# EasyEDA Pro project Fido2.epro

# Schematic Fido2
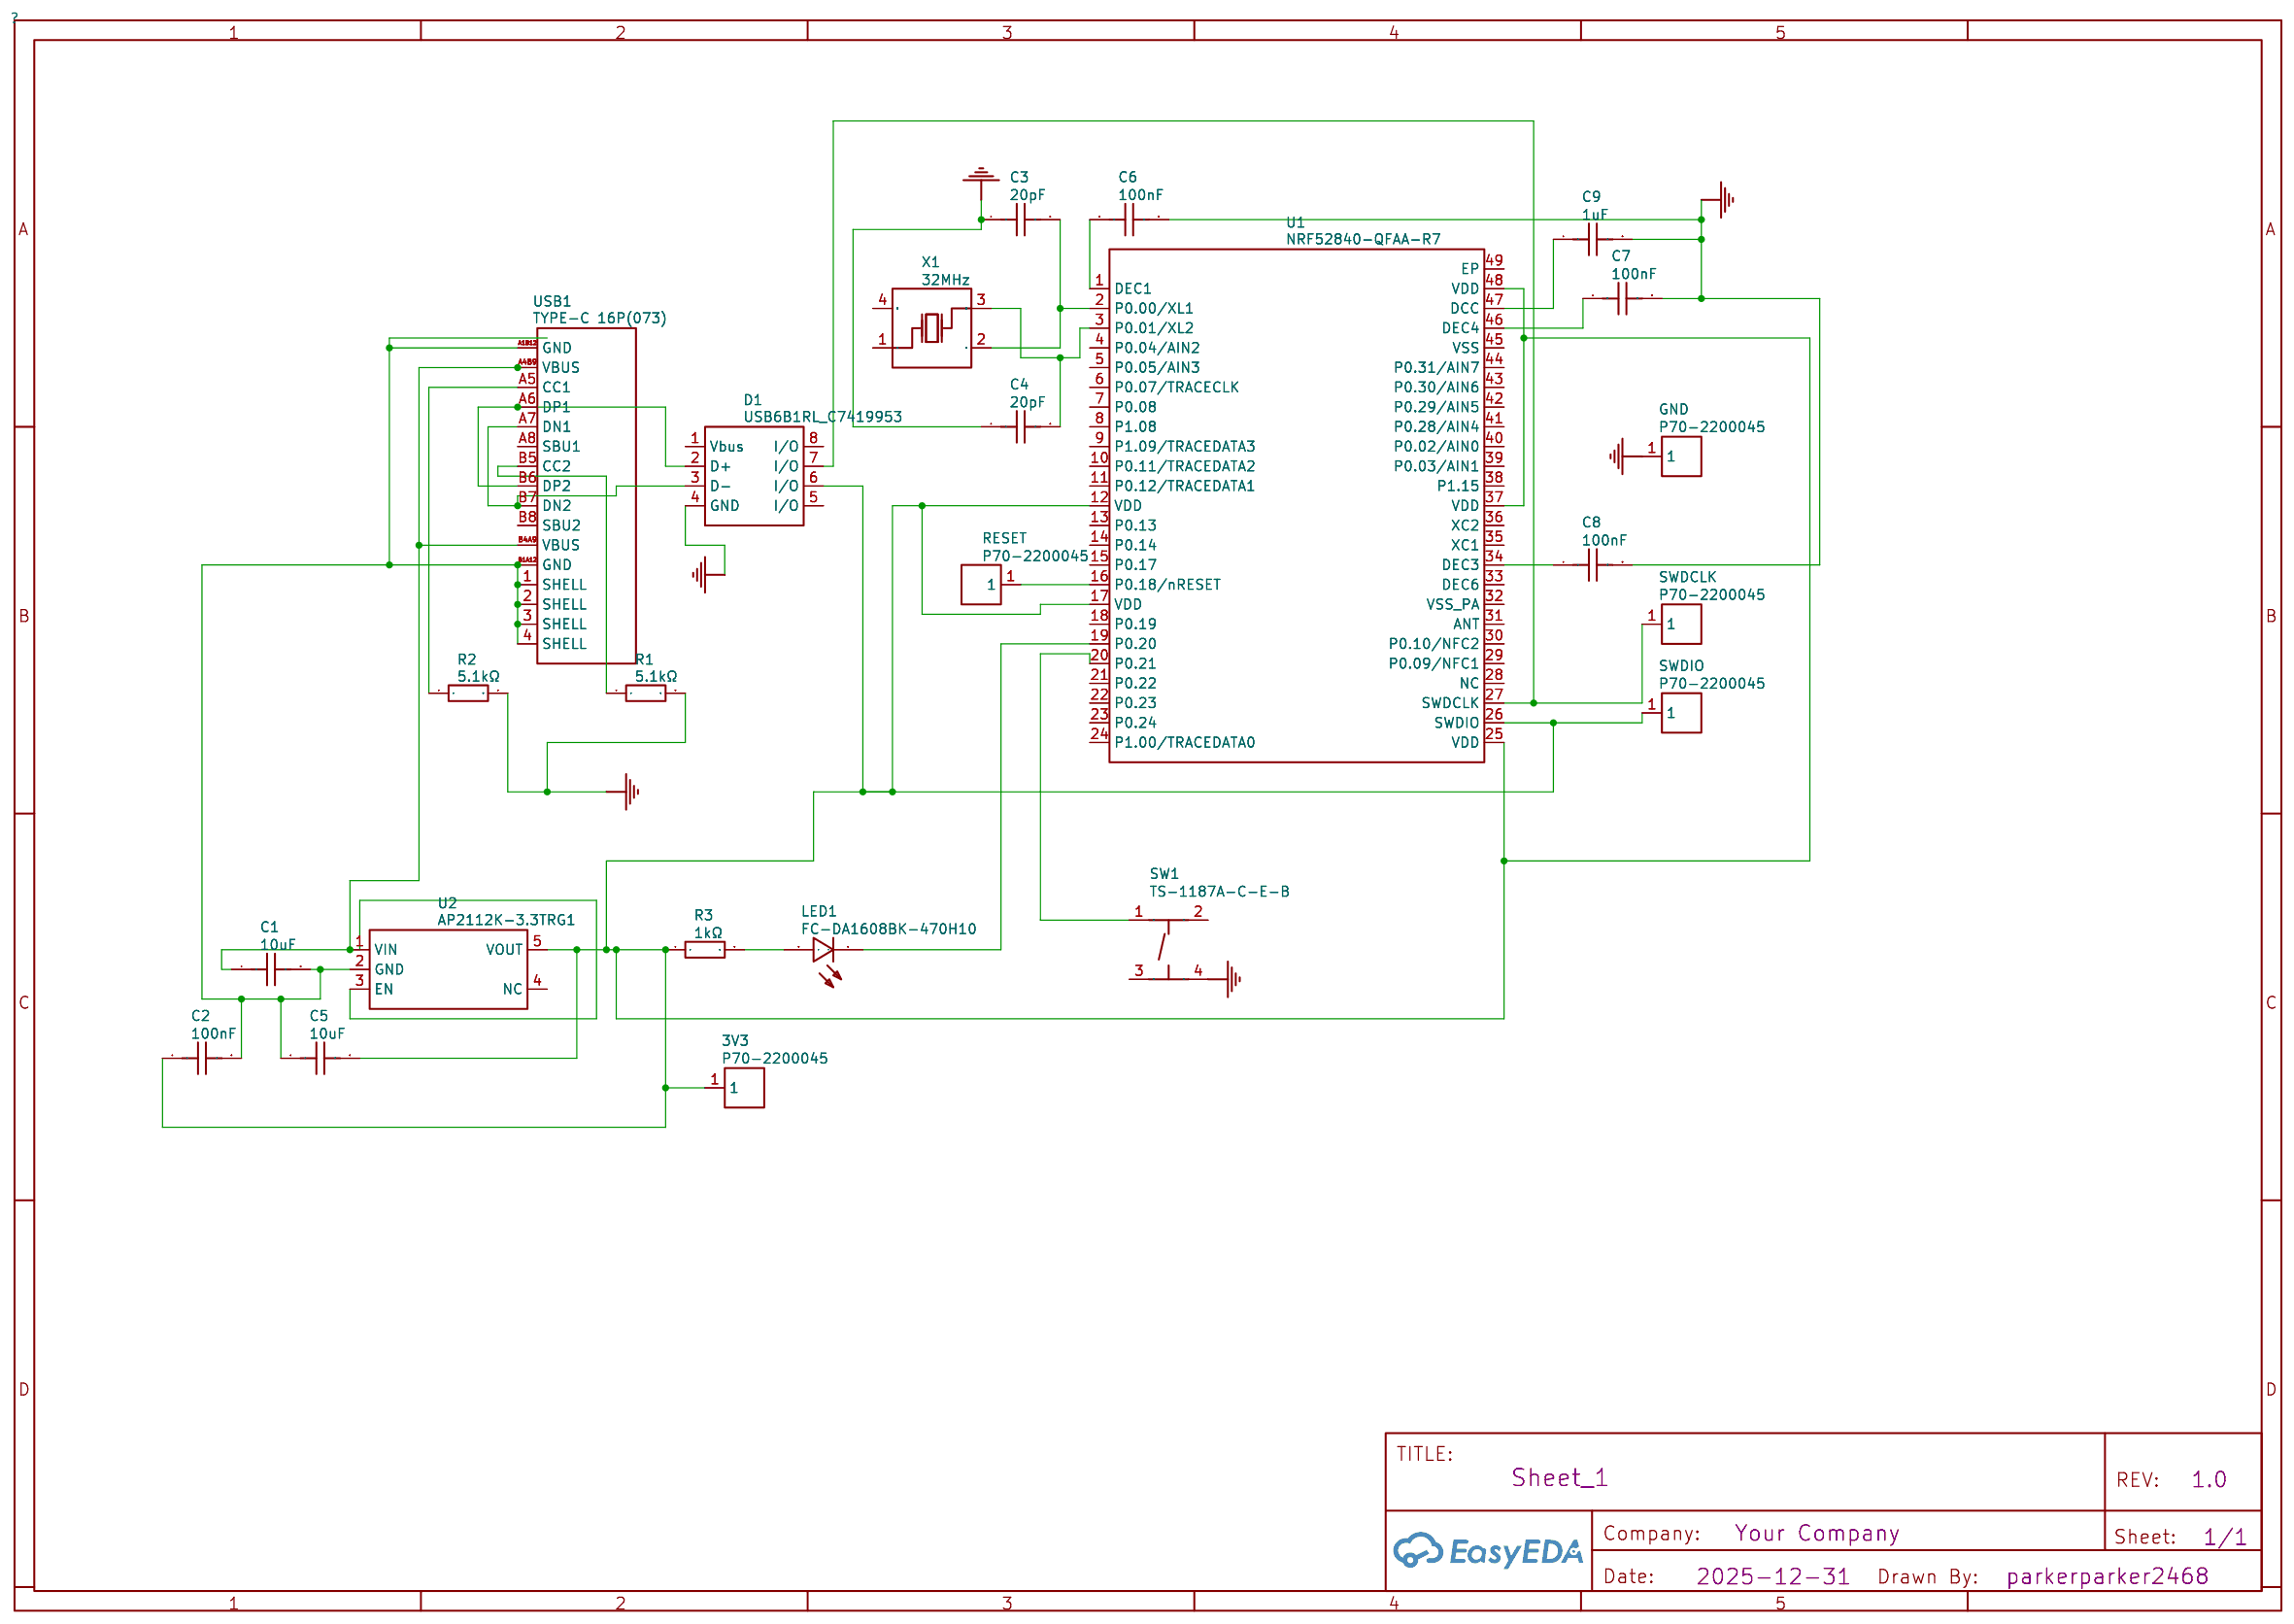
[diagram p0: schematic sheet]

## Parts
3V3  P70-2200045  [TESTPOINT-TH_BD2.0-D1.0_TESTPOINT-TH_BD2.0-D1.0]
C1  10uF  [C0603]
C2  100nF  [C0603]
C3  20pF  [C0603]
C4  20pF  [C0603]
C5  10uF  [C0603]
C6  100nF  [C0603]
C7  100nF  [C0603]
C8  100nF  [C0603]
C9  1uF  [C0603]
D1  USB6B1RL_C7419953  [SOP-8_L4.9-W3.9-P1.27-LS6.0-BL]
GND  P70-2200045  [TESTPOINT-TH_BD2.0-D1.0_TESTPOINT-TH_BD2.0-D1.0]
LED1  FC-DA1608BK-470H10  [LED0603-RD]
R1  5.1kΩ  [R0603]
R2  5.1kΩ  [R0603]
R3  1kΩ  [R0603]
RESET  P70-2200045  [TESTPOINT-TH_BD2.0-D1.0_TESTPOINT-TH_BD2.0-D1.0]
SW1  TS-1187A-C-E-B  [SW-SMD_4P-L5.1-W5.1-P3.70-LS6.5-TL_H2.5]
SWDCLK  P70-2200045  [TESTPOINT-TH_BD2.0-D1.0_TESTPOINT-TH_BD2.0-D1.0]
SWDIO  P70-2200045  [TESTPOINT-TH_BD2.0-D1.0_TESTPOINT-TH_BD2.0-D1.0]
U1  NRF52840-QFAA-R7  [QFN-48_L6.0-W6.0-P0.40-TL-EP4.6]
U2  AP2112K-3.3TRG1  [SOT-25-5_L2.9-W1.6-P0.95-LS2.8-BL]
USB1  TYPE-C 16P(073)  [USB-C-SMD_TYPE-C16PIN_C668624]
X1  32MHz  [CRYSTAL-SMD_4P-L3.2-W2.5-BL]

## Library data of the parts
3V3 RESET SWDCLK SWDIO = P70-2200045: Supplier: LCSC; Supplier Part: C21890164; Manufacturer: Harwin; JLCPCB Part Class: Extended Part; Contributor: lcsc; spicePre: U
C1 C5 = 10uF: Supplier: LCSC; Manufacturer: muRata(村田); Manufacturer Part: GRM188R61E106MA73D; Supplier Part: C91606; JLCPCB Part Class: Extended Part; nameAlias: Value; spicePre: C; spiceSymbolName: GRM188R61E106MA73D
C2 C6-C8 = 100nF: Supplier: LCSC; Manufacturer: YAGEO(国巨); Manufacturer Part: CC0603KRX7R9BB104; Supplier Part: C14663; JLCPCB Part Class: Basic Part; nameAlias: Value; spicePre: C; spiceSymbolName: CC0603KRX7R9BB104
C3 C4 = 20pF: Supplier: LCSC; Manufacturer: FH(风华); Manufacturer Part: 0603CG200J500NT; Supplier Part: C91702; JLCPCB Part Class: Extended Part; nameAlias: Value; spicePre: C; spiceSymbolName: 0603CG200J500NT
C9 = 1uF: Supplier: LCSC; Manufacturer Part: CL10A105KB8NNNC; Manufacturer: SAMSUNG(三星); Supplier Part: C15849; JLCPCB Part Class: Basic Part; nameAlias: Value; spicePre: C; spiceSymbolName: CL10A105KB8NNNC
D1 = USB6B1RL_C7419953: Supplier: LCSC; Supplier Part: C7419953; Manufacturer: TECH PUBLIC(台舟); Manufacturer Part: USB6B1RL; JLCPCB Part Class: Extended Part; Contributor: lcsc; spicePre: D
GND = P70-2200045: Supplier: LCSC; Supplier Part: C21890164; Manufacturer: Harwin; JLCPCB Part Class: Extended Part; Contributor: lcsc; spicePre: U; Package Display: No
LED1 = FC-DA1608BK-470H10: Supplier: LCSC; Manufacturer: 国星光电; Manufacturer Part: NCD0603B1; Supplier Part: C84266; JLCPCB Part Class: Extended Part; spicePre: L
R1 R2 = 5.1kΩ: Supplier: LCSC; Manufacturer: YAGEO(国巨); Manufacturer Part: RC0603FR-075K1L; Supplier Part: C105580; JLCPCB Part Class: Extended Part; nameAlias: Value; spicePre: R; spiceSymbolName: RC0603FR-075K1L
R3 = 1kΩ: Supplier: LCSC; Manufacturer Part: RC0603FR-071KL; Manufacturer: YAGEO(国巨); Supplier Part: C22548; JLCPCB Part Class: Extended Part; nameAlias: Value; spicePre: R; spiceSymbolName: RC0603FR-071KL
SW1 = TS-1187A-C-E-B: Supplier: LCSC; Supplier Part: C318887; Manufacturer: XKB Connection(中国星坤); JLCPCB Part Class: Extended Part; Contributor: LCSC; spicePre: S
U1 = NRF52840-QFAA-R7: Supplier: LCSC; Supplier Part: C3606765; Manufacturer: NORDIC; JLCPCB Part Class: Extended Part; Contributor: lcsc; spicePre: U
U2 = AP2112K-3.3TRG1: Supplier: LCSC; Manufacturer: DIODES(美台); Supplier Part: C51118; JLCPCB Part Class: Extended Part; Contributor: LCSC; spicePre: U
USB1 = TYPE-C 16P(073): Supplier: LCSC; Supplier Part: C668624; Manufacturer: SHOU HAN(首韩); JLCPCB Part Class: Extended Part; Contributor: LCSC; spicePre: U
X1 = 32MHz: Supplier: LCSC; Manufacturer: YXC(扬兴晶振); Manufacturer Part: X322532MOB4SI; Supplier Part: C9009; JLCPCB Part Class: Extended Part; nameAlias: Value; spicePre: X; spiceSymbolName: X322532MOB4SI

## Nets
GND: C3.1 C4.1 C6.2 C7.2 C8.2 C9.2 D1.4(GND) GND.1 R1.2 R2.2 SW1.4(D)
LED1_2: LED1.2(+) R3.2
U1_1: C6.1 U1.1(DEC1)
U1_2: C3.2 U1.2(P0.00/XL1) X1.2(GND)
U1_3: C4.2 U1.3(P0.01/XL2) X1.3(OSC2)
U1_12: 3V3.1 C2.1 C5.2 R3.1 U1.12(VDD) U1.17(VDD) U1.25(VDD) U1.37(VDD) U1.48(VDD) U2.5(VOUT)
U1_16: RESET.1 U1.16(P0.18/nRESET)
U1_19: LED1.1(-) U1.19(P0.20)
U1_20: SW1.1(A) U1.20(P0.21)
U1_26: D1.6(I/O) SWDIO.1 U1.26(SWDIO)
U1_27: D1.7(I/O) SWDCLK.1 U1.27(SWDCLK)
U1_34: C8.1 U1.34(DEC3)
U1_46: C7.1 U1.46(DEC4)
U1_47: C9.1 U1.47(DCC)
USB1_4: C1.2 C2.2 C5.1 U2.2(GND) USB1.1(SHELL) USB1.2(SHELL) USB1.3(SHELL) USB1.4(SHELL) USB1.A1B12(GND) USB1.B1A12(GND)
USB1_A5: R2.1 USB1.A5(CC1)
USB1_B4A9: C1.1 U2.1(VIN) U2.3(EN) USB1.A4B9(VBUS) USB1.B4A9(VBUS)
USB1_B5: R1.1 USB1.B5(CC2)
USB1_B6: D1.2(D+) USB1.A6(DP1) USB1.B6(DP2)
USB1_B7: D1.3(D-) USB1.A7(DN1) USB1.B7(DN2)

Not connected (* = marked no-connect by the designer): D1 1(Vbus) 5(I/O) 8(I/O); SW1 2(B) 3(C); U1 4(P0.04/AIN2) 5(P0.05/AIN3) 6(P0.07/TRACECLK) 7(P0.08) 8(P1.08) 9(P1.09/TRACEDATA3) 10(P0.11/TRACEDATA2) 11(P0.12/TRACEDATA1) 13(P0.13) 14(P0.14) 15(P0.17) 18(P0.19) 21(P0.22) 22(P0.23) 23(P0.24) 24(P1.00/TRACEDATA0) 28(NC) 29(P0.09/NFC1) 30(P0.10/NFC2) 31(ANT) 32(VSS_PA) 33(DEC6) 35(XC1) 36(XC2) 38(P1.15) 39(P0.03/AIN1) 40(P0.02/AIN0) 41(P0.28/AIN4) 42(P0.29/AIN5) 43(P0.30/AIN6) 44(P0.31/AIN7) 45(VSS) 49(EP); U2 4(NC); USB1 A8(SBU1) B8(SBU2); X1 1(OSC1) 4(GND)

# Board PCB_Fido2
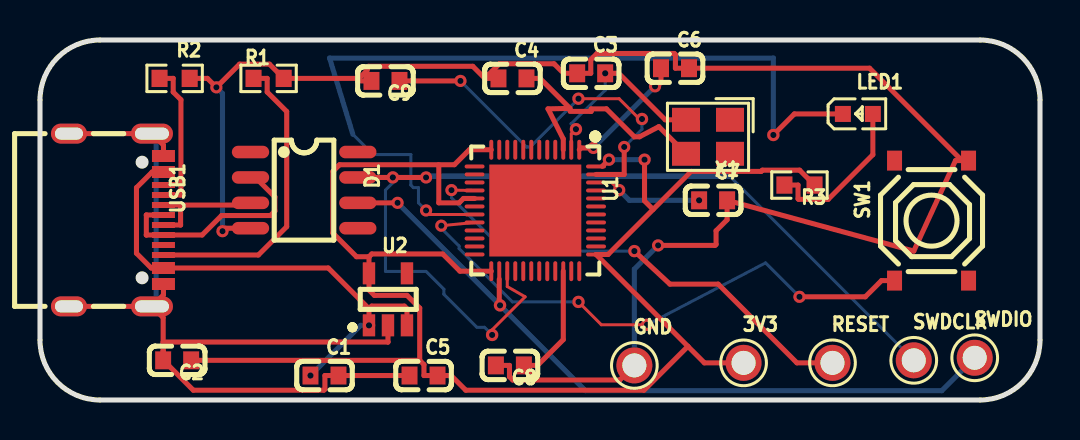
[diagram p1: board, top side]
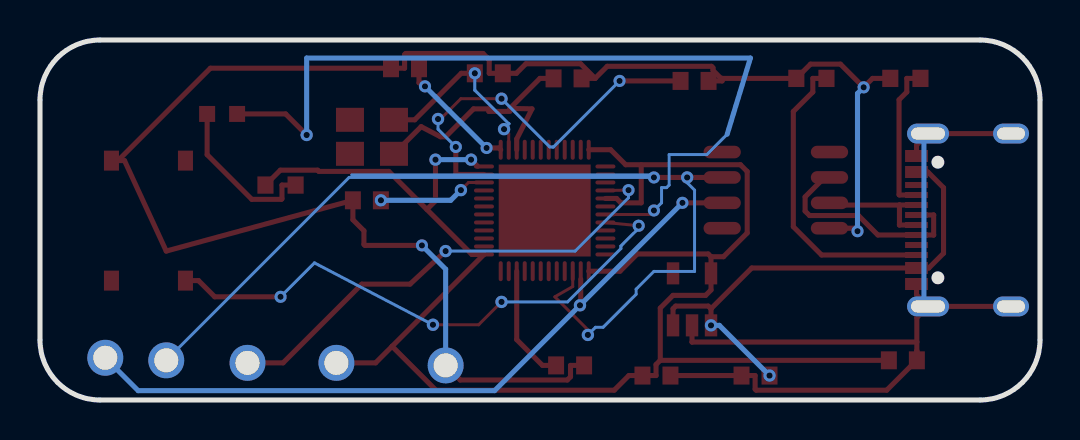
[diagram p2: board, bottom side, seen from below]

Outline 50 x 18 mm; copper layers: Top Layer, Bottom Layer. Coordinates in mm from the lower left corner of the outline.
Outline path: 0,15 arc(0.88,17.12) 3,18 47,18 arc(49.12,17.12) 50,15 50,3 arc(49.12,0.88) 47,0 3,0 arc(0.88,0.88) 0,3 0,15

## Design rules (mm)
via Default (default): diameter min 0.61, default 0.61, max 100.025; hole min 0.305, default 0.305, max 59.995

## Placement (name value [footprint] x y rotation side)
3V3  P70-2200045  [TESTPOINT-TH_BD2.0-D1.0_TESTPOINT-TH_BD2.0-D1.0]  35.18 1.86 0 top
C1  10uF  [C0603]  14.22 1.22 0 top
C2  100nF  [C0603]  6.86 1.98 180 top
C3  20pF  [C0603]  27.56 16.33 0 top
C4  20pF  [C0603]  23.62 16.08 0 top
C5  10uF  [C0603]  19.18 1.22 0 top
C6  100nF  [C0603]  31.75 16.59 0 top
C7  100nF  [C0603]  33.66 9.98 0 top
C8  100nF  [C0603]  23.5 1.73 180 top
C9  1uF  [C0603]  17.27 15.95 180 top
D1  USB6B1RL_C7419953  [SOP-8_L4.9-W3.9-P1.27-LS6.0-BL]  13.21 10.49 270 top
GND  P70-2200045  [TESTPOINT-TH_BD2.0-D1.0_TESTPOINT-TH_BD2.0-D1.0]  29.72 1.73 0 top
LED1  FC-DA1608BK-470H10  [LED0603-RD]  40.89 14.3 0 top
R1  5.1kΩ  [R0603]  11.43 16.08 0 top
R2  5.1kΩ  [R0603]  6.73 16.08 0 top
R3  1kΩ  [R0603]  37.97 10.75 180 top
RESET  P70-2200045  [TESTPOINT-TH_BD2.0-D1.0_TESTPOINT-TH_BD2.0-D1.0]  39.62 1.86 0 top
SW1  TS-1187A-C-E-B  [SW-SMD_4P-L5.1-W5.1-P3.70-LS6.5-TL_H2.5]  44.58 8.97 90 top
SWDCLK  P70-2200045  [TESTPOINT-TH_BD2.0-D1.0_TESTPOINT-TH_BD2.0-D1.0]  43.69 1.98 0 top
SWDIO  P70-2200045  [TESTPOINT-TH_BD2.0-D1.0_TESTPOINT-TH_BD2.0-D1.0]  46.74 2.11 0 top
U1  NRF52840-QFAA-R7  [QFN-48_L6.0-W6.0-P0.40-TL-EP4.6]  24.76 9.48 270 top
U2  AP2112K-3.3TRG1  [SOT-25-5_L2.9-W1.6-P0.95-LS2.8-BL]  17.4 5.03 0 top
USB1  TYPE-C 16P(073)  [USB-C-SMD_TYPE-C16PIN_C668624]  3.81 9 270 top
X1  32MHz  [CRYSTAL-SMD_4P-L3.2-W2.5-BL]  33.4 13.16 180 top

## Footprints (pads in the part's own frame, mm; a bottom-side part is the same pattern mirrored in y, then rotated)
C0603
  rect 0.8x0.9 smd: 1(-0.7,0) 2(0.7,0)
CRYSTAL-SMD_4P-L3.2-W2.5-BL
  rect 1.4x1.2 smd: 1(-1.1,-0.85) 2(1.1,-0.85) 3(1.1,0.85) 4(-1.1,0.85)
LED0603-RD
  rect 0.8x0.8 smd: 1(-0.749,0) 2(0.749,0)
QFN-48_L6.0-W6.0-P0.40-TL-EP4.6
  oval 1x0.2 smd: 1(-3.036,2.199) 2(-3.036,1.798) 3(-3.036,1.399) 4(-3.036,0.999) 5(-3.036,0.599) 6(-3.036,0.199) 7(-3.036,-0.201) 8(-3.036,-0.602) 9(-3.036,-1.001) 10(-3.036,-1.401) 11(-3.036,-1.802) 12(-3.036,-2.201) 25(3.036,-2.201) 26(3.036,-1.802) 27(3.036,-1.401) 28(3.036,-1.001) 29(3.036,-0.602) 30(3.036,-0.201) 31(3.036,0.199) 32(3.036,0.599) 33(3.036,0.999) 34(3.036,1.399) 35(3.036,1.798) 36(3.036,2.199)
  oval 0.2x1 smd: 13(-2.199,-3.036) 14(-1.799,-3.036) 15(-1.399,-3.036) 16(-0.999,-3.036) 17(-0.599,-3.036) 18(-0.199,-3.036) 19(0.201,-3.036) 20(0.601,-3.036) 21(1.001,-3.036) 22(1.401,-3.036) 23(1.801,-3.036) 24(2.201,-3.036) 37(2.201,3.036) 38(1.801,3.036) 39(1.401,3.036) 40(1.001,3.036) 41(0.601,3.036) 42(0.201,3.036) 43(-0.199,3.036) 44(-0.599,3.036) 45(-0.999,3.036) 46(-1.399,3.036) 47(-1.799,3.036) 48(-2.199,3.036)
  rect 4.6x4.6 smd: 49(0.003,0.001)
R0603
  rect 0.806x0.864 smd: 1(-0.753,0) 2(0.753,0)
SOP-8_L4.9-W3.9-P1.27-LS6.0-BL
  oval 0.63x1.865 smd: 1(-1.905,-2.683) 2(-0.635,-2.683) 3(0.635,-2.683) 4(1.905,-2.683) 5(1.905,2.683) 6(0.635,2.683) 7(-0.635,2.683) 8(-1.905,2.683)
SOT-25-5_L2.9-W1.6-P0.95-LS2.8-BL
  rect 0.623x1.105 smd: 1(-0.95,-1.3) 2(-0.001,-1.3) 3(0.95,-1.3) 4(0.95,1.3) 5(-0.95,1.3)
SW-SMD_4P-L5.1-W5.1-P3.70-LS6.5-TL_H2.5
  rect 1x0.75 smd: 1(-3,1.85) 2(3,1.85) 3(-3,-1.85) 4(3,-1.85)
TESTPOINT-TH_BD2.0-D1.0_TESTPOINT-TH_BD2.0-D1.0
  round 1.8 hole 1.2: 1(0,0)
USB-C-SMD_TYPE-C16PIN_C668624
  oval 1x2.1 hole 0.6x1.7: 1(-4.32,1.788) 2(4.32,1.788)
  oval 1x1.8 hole 0.6x1.4: 3(-4.32,-2.362) 4(4.32,-2.362)
  rect 0.6x1.15 smd: A1B12(-3.2,2.362) A4B9(-2.4,2.362) B1A12(3.2,2.362) B4A9(2.4,2.362)
  rect 0.3x1.15 smd: A5(-1.25,2.362) A6(-0.25,2.362) A7(0.25,2.362) A8(1.25,2.362) B5(1.75,2.362) B6(0.75,2.362) B7(-0.75,2.362) B8(-1.75,2.362)

## Nets
As in the schematic.

## Via types
v1: diameter 0.61, hole 0.305, Top Layer to Bottom Layer, 13 vias
v2: diameter 0.62, hole 0.31, Top Layer to Bottom Layer, 17 vias

## Routing (per net, layer and track width the routed paths; a pad name or vN(x,y) marks a point on that pad's centre or on a via; arc(x,y) is an arc through that point)
GND: length 89.4
  Top Layer w0.254: R2.2 8.37,16.08 v1(8.82,15.63) 9.98,16.79 11.47,16.79 R1.2 15.89,16.08 ; GND.1 28.99,1 23.63,1 23.47,1.16 23.47,1.73 22.79,1.73 ; 46.1,11.97 41.48,16.59 C6.2 31.77,16.59 31.77,17.27 31.71,17.33 27.85,17.33 27.54,17.01 27.54,16.33 C3.1 26.18,16.33 25.7,16.81 22.97,16.81 22.24,16.08 ; 46.1,11.97 45.77,11.97 ; 46.1,11.97 SW1.4 ; 22.24,16.08 21.64,16.69 16.42,16.69 16.35,16.61 16.35,16.48 15.95,16.08 15.89,16.08 ; 22.24,16.08 C4.1 ; 15.89,16.08 15.89,15.95 C9.2 ; v1(9.12,8.44) 9.27,8.59 D1.4 ; 45.77,11.97 43.69,7.44 C7.2 34.35,9.01 33.8,8.46 33.8,7.78 33.75,7.73 v1(30.91,7.73)
  Bottom Layer w0.254: v1(30.91,7.73) 29.72,6.54 GND.1 ; v1(8.82,15.63) 9.12,15.33 v1(9.12,8.44)
LED1_2: length 8.1
  Top Layer w0.254: R3.2 37.9,10.75 37.9,10.06 37.93,10.03 39.41,10.03 41.64,12.27 LED1.2
U1_1: length 6.2
  Top Layer w0.254: U1.1 27.05,12.6 v1(27.67,12.6) ; v1(30.75,15.68) 30.93,15.86 31.05,15.86 C6.1
  Bottom Layer w0.254: v1(27.67,12.6) v1(30.75,15.68)
U1_2: length 9.7
  Top Layer w0.15: v2(26.8,13.54) 26.56,13.31 U1.2
  Top Layer w0.254: X1.2 31.26,14.01 28.94,16.33 v2(28.26,16.33)
  Bottom Layer w0.15: 26.56,13.81 28.26,15.49 28.26,16.33 ; 26.55,13.81 26.8,13.56 v2(26.8,13.54)
U1_3: length 13.3
  Top Layer w0.254: C4.2 25,16.08 26.5,14.58 25.4,14.56 26.16,13.05 U1.3 ; 26.5,14.43 27.56,14.43 27.56,14.56 28.32,14.56 29.72,13.16 29.97,13.16 30.94,13.67 32.3,12.31
U1_12: length 85.5
  Top Layer w0.15: 21.37,10.11 21.37,10.08
  Top Layer w0.254: 18.99,1.98 18.99,4.6 18.35,5.23 16.72,5.23 16.45,5.5 U2.5 16.45,7.16 ; 18.99,1.98 C2.1 ; 18.99,1.98 19.2,1.77 19.2,1.22 20.56,1.22 21.29,0.49 30.2,0.49 32.39,2.68 ; U1.25 21,6.44 20.14,7.3 16.59,7.3 16.45,7.16 ; 30.66,9.53 30.23,9.96 v2(30.23,12.02) ; 32.39,2.68 33.22,1.86 3V3.1 ; 32.39,2.68 U1.37 28.4,7.28 32.56,11.43 36.06,11.43 36.12,11.49 37.98,11.49 R3.1 ; 16.45,7.16 15.83,7.16 14.64,8.35 14.64,11.43 14.98,11.76 20.72,11.76 21.47,12.51 U1.12 ; 19.94,11.76 19.94,9.86 20.95,9.86 21.17,10.08 U1.17 ; v2(28.45,12.02) 28.12,11.68
  Bottom Layer w0.254: v2(28.45,12.02) v2(30.23,12.02)
U1_16: length 24
  Top Layer w0.15: v1(20.57,10.49) U1.16
  Top Layer w0.254: v2(29.72,7.44) 31.5,5.79 33.91,5.79 37.85,1.86 RESET.1
  Bottom Layer w0.15: v2(29.72,7.44) 23.24,7.44 20.57,10.11 v1(20.57,10.49)
U1_19: length 43.1
  Top Layer w0.15: v1(19.3,9.48) 19.5,9.28 U1.19
  Top Layer w0.254: 36.58,13.16 37.72,14.3 LED1.1
  Bottom Layer w0.15: 15.64,13.29 16.66,12.27 18.54,12.27 18.54,10.75 18.67,10.62 18.92,10.62 18.92,9.86 v1(19.3,9.48)
  Bottom Layer w0.254: v2(36.67,13.25) 36.67,17.1 14.48,17.1 15.64,13.29
U1_20: length 28.3
  Top Layer w0.15: v1(20.07,8.72) U1.20 21.73,8.87 ; v2(30.35,3.76) 28.07,3.76 v2(26.92,4.91)
  Top Layer w0.254: SW1.1 42.07,5.97 41.26,5.16 v1(37.97,5.16)
  Bottom Layer w0.15: v2(26.92,4.91) 23.62,4.91 20.95,7.57 20.95,7.7 20.19,8.46 20.19,8.59 v1(20.07,8.72) ; v1(37.97,5.16) 36.28,6.86 v2(30.35,3.76)
U1_26: length 36.7
  Top Layer w0.254: D1.6 v1(17.88,9.86) ; 22.96,6.03 22.96,4.77 v2(23,4.73)
  Bottom Layer w0.254: v1(17.88,9.86) v2(23,4.73) 27.27,0.47 45.09,0.47 SWDIO.1
U1_27: length 62.8
  Top Layer w0.15: 23.36,6.44 23.36,5.67 24.26,5.16 22.61,3.51 v2(22.61,3.25)
  Top Layer w0.254: D1.7 v2(17.64,11.13) v1(19.3,11.13)
  Bottom Layer w0.15: v2(17.64,11.13) 17.64,10.86 17.27,10.49 17.27,6.43 19.3,6.43 20.19,5.54 20.19,5.29 21.84,3.64 22.22,3.64 v2(22.61,3.25) ; 34.42,11.25 19.43,11.25 v1(19.3,11.13) 34.54,11.13 SWDCLK.1
U1_34: length 5.9
  Top Layer w0.254: U1.34 26.16,3.02 24.87,1.73 C8.1
U1_46: length 5.5
  Top Layer w0.15: U1.46 28.57,10.88 v2(28.96,10.49)
  Bottom Layer w0.254: v2(28.96,10.49) 29.46,9.98 v2(32.95,9.98)
U1_47: length 19.5
  Top Layer w0.15: v2(30.1,14.05) 29.97,14.18 29.84,14.18 28.96,15.06 v2(26.92,15.06)
  Top Layer w0.254: C9.1 v1(21.02,15.95) ; 27.8,11.28 29.21,11.28 v1(29.21,12.65)
  Bottom Layer w0.15: v1(29.21,12.65) 30.1,13.54 v2(30.1,14.05) ; v2(26.92,15.06) 24.51,12.65 24.32,12.65 ; v1(21.02,15.95) 24.32,12.65 ; 24.32,12.65 24.38,12.65
USB1_4: length 48.9
  Top Layer w0.254: USB1.A1B12 6.17,12.75 USB1.1 USB1.3 ; USB1.4 USB1.2 ; USB1.2 6.17,5.25 USB1.B1A12 ; USB1.2 6.16,4.12 6.16,2.9 ; 6.16,2.46 6.16,2 7.66,0.49 14.19,0.49 14.25,0.54 14.25,1.22 C1.2 C5.1 ; 6.16,2.46 C2.2 ; 6.16,2.46 6.16,2.9 ; 6.16,2.9 17.4,2.9 17.4,2.9 U2.2
  Bottom Layer w0.254: USB1.1 5.8,13.11 5.8,4.89 USB1.2
USB1_A5: length 7.5
  Top Layer w0.254: R2.1 6.66,16.08 6.66,15.4 7.05,15.01 7.05,10.27 7.03,10.25 USB1.A5
USB1_B4A9: length 25.4
  Top Layer w0.254: USB1.A4B9 5.61,11.4 4.82,10.61 4.82,7.34 5.56,6.6 USB1.B4A9 14.41,6.6 16.45,4.56 16.45,4.56 ; 16.45,4.56 16.59,4.7 18.22,4.7 18.35,4.56 U2.3 ; 16.45,4.56 v2(16.45,3.73)
  Bottom Layer w0.254: v2(13.52,1.22) 16.03,3.73 v2(16.45,3.73)
USB1_B5: length 15.3
  Top Layer w0.254: USB1.B5 10.92,7.25 12.33,8.67 12.33,14.42 11.36,15.4 11.36,16.08 R1.1
USB1_B6: length 11.1
  Top Layer w0.254: D1.2 10.77,11.13 11.74,10.15 11.74,9.44 11.52,9.22 9.08,9.22 8.11,8.25 USB1.B6 5.32,8.25 5.32,8.25 5.32,9.25 5.32,9.25 USB1.A6
USB1_B7: length 6.3
  Top Layer w0.254: 7.03,9.75 10.42,9.75 D1.3 ; 7.03,9.75 7.03,8.75 7.03,8.75 USB1.A7 ; 7.03,9.75 7.03,9.75 USB1.B7
